# EasyEDA Pro project ProProject_aaa-Zee_2026-06-16.epro

# Schematic Schematic1
Assembly Variant: Basic; Board Name: Board1; Create Date: 2026-06-15; Page Name: P1; Project Name: aaa-Zee; Schematic Name: Schematic1; Update Date: 2026-06-16; Company: 嘉立创EDA; Page Size: A4; Version: V1.0
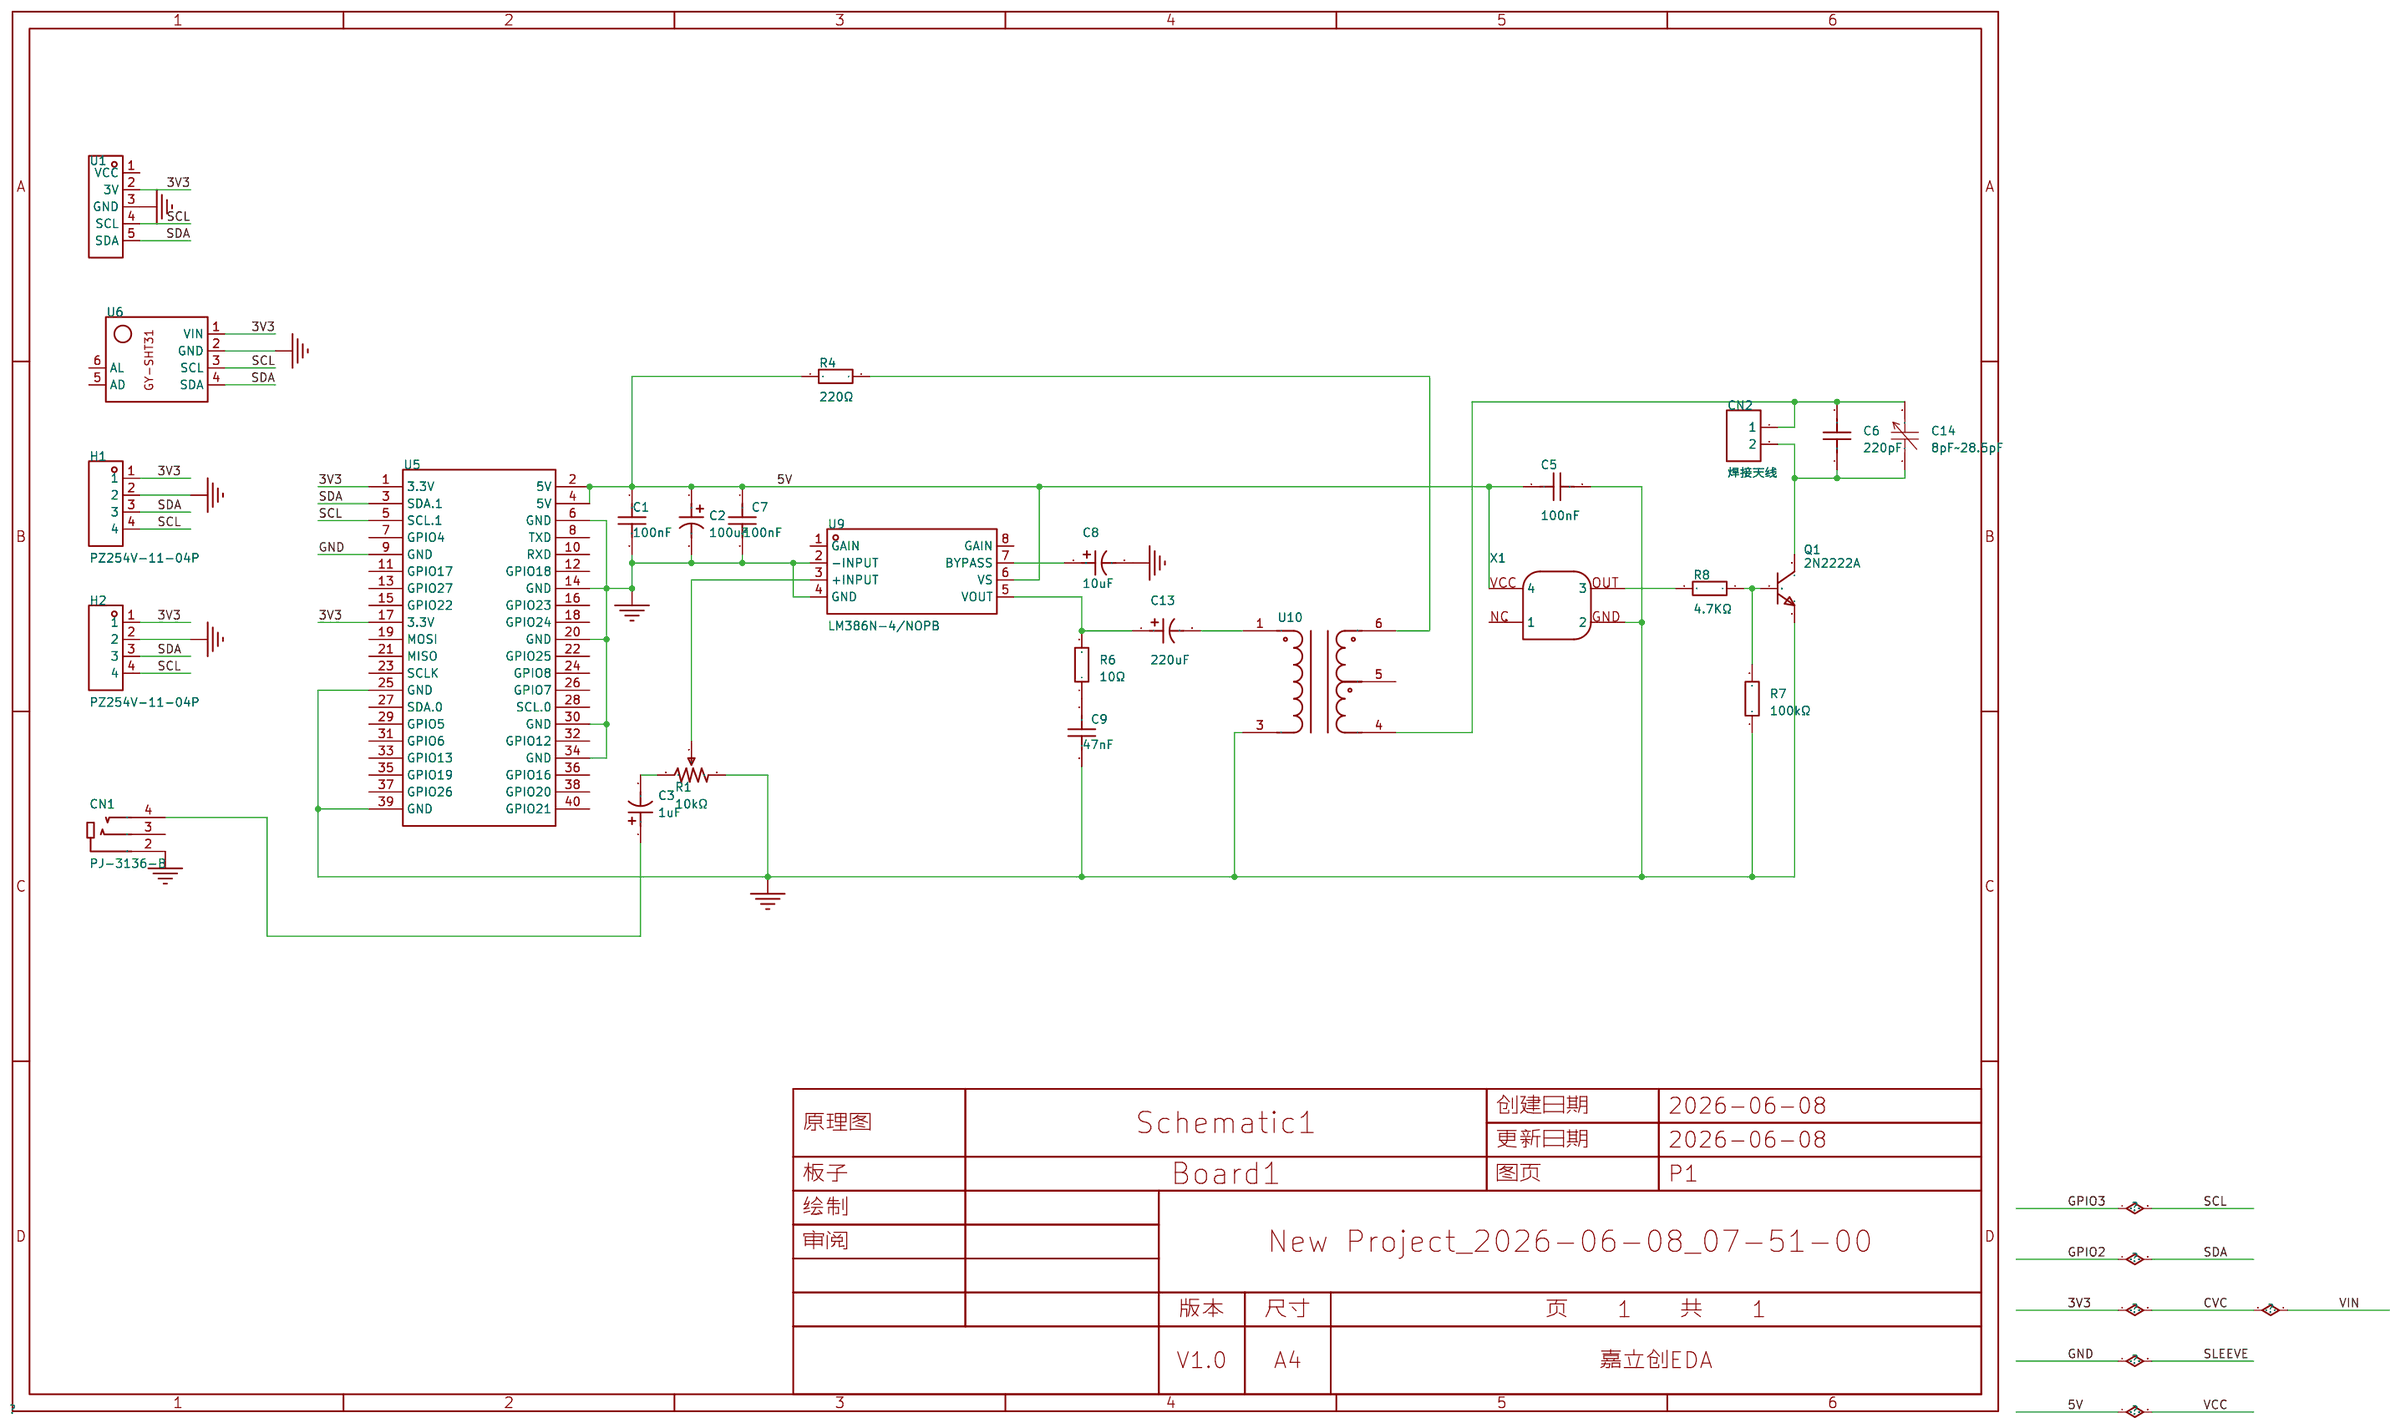
[diagram p0: schematic sheet]

## Parts
C1  100nF  [CAP-TH_L6.5-W3.5-P5.00-D0.5]
C2  100uF  [CAP-TH_BD6.3-P2.50-D0.6-FD]
C3  1uF  [CAP-TH_BD6.3-P2.50-D0.6-FD]
C5  100nF  [CAP-TH_L6.5-W3.5-P5.00-D0.5]
C6  220pF  [CAP-TH_L5.5-W2.0-P5.00-D1.0]
C7  100nF  [CAP-TH_L6.5-W3.5-P5.00-D0.5]
C8  10uF  [CAP-TH_BD6.3-P2.50-D0.6-FD]
C9  47nF  [CAP-TH_L6.5-W3.5-P5.00-D0.5]
C13  220uF  [CAP-TH_BD8.0-P3.50-D0.5-FD]
C14  8pF~28.5pF  [可调电容6MM]
CN1  PJ-3136-B  [AUDIO-TH_PJ-3136-B]
CN2  焊接天线  [CONN-TH_WJ2EDGVC-5.08-2P]
H1  PZ254V-11-04P  [HDR-TH_4P-P2.54-V-M]
H2  PZ254V-11-04P  [HDR-TH_4P-P2.54-V-M]
Q1  2N2222A  [TO-92-3_L4.9-W3.7-P1.27-L]
R1  10kΩ  [RES-ADJ-TH_3296W]
R4  220Ω  [Res_1/4W]
R6  10Ω  [Res_1/4W]
R7  100kΩ  [Res_1/4W]
R8  4.7KΩ  [Res_1/4W]
U1  -  [VEML7700]
U5  -  [树莓派4B]
U6  -  [DIP-2X6P2.54-L4R2]
U9  LM386N-4/NOPB  [DIP-8_L9.6-W6.4-P2.54-LS7.6-BL-1]
U10  -  [XFMR-TH_EI14-600]
X1  -  [方形有源晶振]

## Library data of the parts
C1 C5 C7 C9 = MPE104J100V82CL0044: 容值:100nF;精度:±5%;额定电压:100V;介电材料:金属化聚酯;工作温度:-55℃~+85℃;; LCSC Part Name: 100nF ±5% 100V; Supplier Part: C2803184; Manufacturer: KNSCHA(科尼盛); Supplier Footprint: 插件,P=5mm; JLCPCB Part Class: Extended Part; Datasheet: https://item.szlcsc.com/datasheet/MPE104J100V82CL0044/2945555.html; Supplier: LCSC; Tolerance: ±5%; Voltage Rating: 100V; Dielectric Material: 金属化聚酯; Operating Temperature: -55℃~+85℃
C2 C3 C8 = ERA35V100M6X7: 容值:100uF;精度:±20%;额定电压:35V;纹波电流:101mA@120Hz;等效串联电阻(ESR):-;; LCSC Part Name: 100uF ±20% 35V; Supplier Part: C49256802; Manufacturer: JIERR(捷而瑞); Supplier Footprint: 插件,D6.3xL7mm; JLCPCB Part Class: Extended Part; Datasheet: https://item.szlcsc.com/datasheet/ERA35V100M6X7/51692202.html; Supplier: LCSC; Tolerance: ±20%; Voltage Rating: 35V; Ripple Current: 101mA@120Hz; Pin Spacing: 2.5mm; Diameter: 6mm; Height - Seated (Max): 7mm; Lifetime: 2000hrs@105℃; Operating Temperature: -40℃~+105℃
C6 = L06B1B101KQ0T0S0N0: 容值:100pF;精度:±10%;额定电压:500V;温度系数:Y5P;; LCSC Part Name: 100pF ±10% 500V; Supplier Part: C366786; Manufacturer: STE(松田); Supplier Footprint: 插件,P=5mm; JLCPCB Part Class: Extended Part; Datasheet: https://item.szlcsc.com/datasheet/L06B1B101KQ0T0S0N0/340720.html; Supplier: LCSC; Tolerance: ±10%; Voltage Rating: 500V; Pin Spacing: 5mm; Temperature Coefficient: Y5P; Diameter: 5.5mm; Body Thickness: 2mm
C13 = ERA35V220M8X12: 容值:220uF;精度:±20%;额定电压:35V;纹波电流:290mA@120Hz;等效串联电阻(ESR):-;; LCSC Part Name: 220uF ±20% 35V; Supplier Part: C49256804; Manufacturer: JIERR(捷而瑞); Supplier Footprint: 插件,D8xL12mm; Datasheet: https://item.szlcsc.com/datasheet/ERA35V220M8X12/51692204.html; Supplier: LCSC; Tolerance: ±20%; Voltage Rating: 35V; Ripple Current: 290mA@120Hz; Pin Spacing: 3.5mm; Diameter: 8mm; Height - Seated (Max): 12mm; Lifetime: 2000hrs@105℃; Operating Temperature: -40℃~+105℃
C14 = STC3ME30-T1_C22468123: 静电容量:8pF~28.5pF;静电容量公差:0%~+50%;额定电压:100V;电荷量:250@1MHz;; LCSC Part Name: 8pF~28.5pF 0%~+50% 100V 250@1MHz; Supplier Part: C22468123; Manufacturer: SEHWA(韩国世华); Manufacturer Part: STC3ME30-T1; Supplier Footprint: SMD,4.5x3.2mm; Datasheet: https://item.szlcsc.com/datasheet/STC3ME30-T1/24174643.html; Supplier: LCSC; Tolerance: 0%~+50%; Voltage Rating: 100V; Q @ Frequency: 250@1MHz; Operating Temperature: -25℃~+85℃; Body Length: 4.5mm; Body Width: 3.2mm; Height - Seated(Max): 1.5mm
CN1 = PJ-3136-B: 连接器类型:3.5mm耳机座;额定电流:500mA;额定电压:30V;触头材质:-;触头镀层:-;工作温度:-20℃~+70℃;; LCSC Part Name: 3.5mm耳机座; Supplier Part: C381131; Manufacturer: XKB Connection(中国星坤); Supplier Footprint: 插件; JLCPCB Part Class: Extended Part; Datasheet: https://item.szlcsc.com/datasheet/PJ-3136-B/353363.html; Supplier: LCSC; Connector Type: 3.5mm耳机座; Current Rating: 500mA; Voltage Rating (Max): 30V; Operating Temperature: -20℃~+70℃
CN2 = WJ2EDGVC-5.08-02P-14-00A: 连接器类型:板端/插座-闭口;固定方式:卡扣固定;结构:1x2P;间距:5.08mm;颜色:绿色;安装方式:直插;排数:1;每排PIN数:2;额定电流:10A;额定电压:300V;线规 - AWG:-;线规 - 平方毫米:-;工作温度:-40℃~+105℃;; LCSC Part Name: 卡扣固定 1x2P 5.08mm 排数:1 每排P数:2; Supplier Part: C8445; Manufacturer: KANGNEX(康奈克斯电气); Supplier Footprint: 插件,P=5.08mm; Datasheet: https://item.szlcsc.com/datasheet/WJ2EDGVC-5.08-02P-14-00A/8939.html; Supplier: LCSC; Connector Type: 板端/插座-闭口; Termination Style: 卡扣固定; Number of Positions or Pins: 1x2P; Pitch: 5.08mm; Color: 绿色; Mounting Type: 直插; Number of Pins: 2P; Number of Rows: 1; Number of PINs Per Row: 2; Current Rating: 10A; Voltage Rating (Max): 300V; Operating Temperature: -40℃~+105℃
H1 H2 = PZ254V-11-04P: 插针结构:1x4P;间距:2.54mm;行距:-;圆针/方针:方针;安装方式:直插;排数:单排;总PIN位数:4P;额定电流:3A;额定电压:250V;配合针长度:6mm;塑高:2.5mm;端接针长度:3mm;触头材质:-;工作温度:-40℃~+105℃;颜色:黑色;; LCSC Part Name: 1x4P 间距:2.54mm 方针 直插; Supplier Part: C2691448; Manufacturer: XFCN(兴飞); Supplier Footprint: 插件,P=2.54mm; JLCPCB Part Class: Extended Part; Datasheet: https://item.szlcsc.com/datasheet/PZ254V-11-04P/2801085.html; Supplier: LCSC; Pin Structure: 1x4P; Pitch: 2.54mm; Circluar Pins/Square Pins: 方针; Mounting Type: 直插; Number of Rows: 单排; Number of Pins: 4P; Current Rating: 3A; Voltage Rating (Max): 250V; Length of Mating Pin: 6mm; Insulation Height: 2.5mm; Length of End Connection Pin: 3mm; Operating Temperature: -40℃~+105℃; Color: 黑色
Q1 = 2N2222A: 晶体管类型:NPN;集电极电流(Ic):600mA;集射极击穿电压(Vceo):40V;耗散功率(Pd):625mW;直流电流增益(hFE):40@500mA,10V;; LCSC Part Name: NPN 电流:600mA 电压:40V; Supplier Part: C118536; Manufacturer: ST(先科); Supplier Footprint: TO-92; JLCPCB Part Class: Extended Part; Datasheet: https://item.szlcsc.com/datasheet/2N2222A/119803.html; Supplier: LCSC; type: NPN; Current - Collector(Ic): 600mA; Collector - Emitter Voltage VCEO: 40V; Pd - Power Dissipation: 625mW; DC Current Gain: 40@500mA,10V; Transition frequency(fT): 250MHz; Current - Collector Cutoff: 10nA; Vce Saturation(VCE(sat)): 1V; Emitter-Base Voltage(Vebo): 6V; Number: 1个NPN
R1 = 3296W-1-103_C48997937: 阻值:10kΩ;精度:±10%;功率:500mW;温度系数:±250ppm/℃;; LCSC Part Name: 玻璃釉预调电位器; Supplier Part: C48997937; Manufacturer: JIERR(捷而瑞); Manufacturer Part: 3296W-1-103; Supplier Footprint: 插件-3P,9.5x4.9mm; JLCPCB Part Class: Extended Part; Datasheet: https://item.szlcsc.com/datasheet/3296W-1-103/51342073.html; Supplier: LCSC; Tolerance: ±10%; Power(Watts): 500mW; Temperature Coefficient: ±250ppm/℃; Number of Turns: 28
R4 R6-R8 = Res_AXIAL-1/4W: Supplier Footprint: 轴向引线
U1 = VEML7700
U5 = 树莓派4B
U6 = GY-SHT31
U9 = LM386N-4/NOPB: 功放类型:AB类功放;扬声器通道数:单声道;输出功率:1Wx1@32Ω;静态电流(Iq):4mA;; LCSC Part Name: 1W单声道AB类音频功率放大器; Supplier Part: C194458; Manufacturer: TI(德州仪器); Supplier Footprint: PDIP-8; Datasheet: https://www.ti.com/cn/lit/gpn/lm386; Supplier: LCSC; Class: AB类功放; Speaker Channels: 单声道; Output Power: 1Wx1@32Ω; Total Harmonic Distortion + Noise (THD+N): 0.2%; Quiescent Current: 4mA; Power Supply Rejection Ratio (PSRR): 50dB; Voltage - Supply: 5V~18V; Operating Temperature: 0℃~+70℃
U10 = 音频变压器_EI14_MY COPY
X1 = 4方形有源晶振12

## Nets
3V3: H1.1 H2.1 U1.2(3V) U5.1(3.3V) U5.17(3.3V) U6.1(VIN)
5V: C1.1 C2.1 C5.1 C7.1 R4.1 U5.2(5V) U5.4(5V) U9.6(VS) X1.4
GND: C1.2 C2.2 C5.2 C7.2 C8.2 C9.2 CN1.2 H1.2 H2.2 Q1.1(E) R1.1 R7.1 U1.3(GND) U5.6(GND) U5.9(GND) U5.14(GND) U5.20(GND) U5.25(GND) U5.30(GND) U5.34(GND) U5.39(GND) U6.2(GND) U9.2(-INPUT) U9.4(GND) U10.3 X1.2
GPIO2: H1.3 H2.3 U1.5(SDA) U5.3(SDA.1) U6.4(SDA)
GPIO3: H1.4 H2.4 U1.4(SCL) U5.5(SCL.1) U6.3(SCL)
$1N41: C13.2 U10.1
$1N43: Q1.2(B) R7.2 R8.1
$1N4529: C3.1 CN1.4
$1N4541: R1.2 U9.3(+INPUT)
$1N4628: C8.1 U9.7(BYPASS)
$1N4912: C13.1 R6.2 U9.5(VOUT)
$1N5156: R8.2 X1.3
$1N5360: C6.1 C14.1 CN2.2 Q1.3(C)
$1N5428: R4.2 U10.6
$1N5437: C6.2 C14.2 CN2.1 U10.4
$1N5480: C9.1 R6.1
$1N6197: C3.2 R1.3

Not connected (* = marked no-connect by the designer): CN1 3; U1 1(VCC); U5 7(GPIO4) 8(TXD) 10(RXD) 11(GPIO17) 12(GPIO18) 13(GPIO27) 15(GPIO22) 16(GPIO23) 18(GPIO24) 19(MOSI) 21(MISO) 22(GPIO25) 23(SCLK) 24(GPIO8) 26(GPIO7) 27(SDA.0) 28(SCL.0) 29(GPIO5) 31(GPIO6) 32(GPIO12) 33(GPIO13) 35(GPIO19) 36(GPIO16) 37(GPIO26) 38(GPIO20) 40(GPIO21); U6 5(AD) 6(AL); U9 1(GAIN) 8(GAIN); U10 5; X1 1
